# EAGLE design YAKS2-TITUO.R04.1bl (EAGLE 9.0.0)
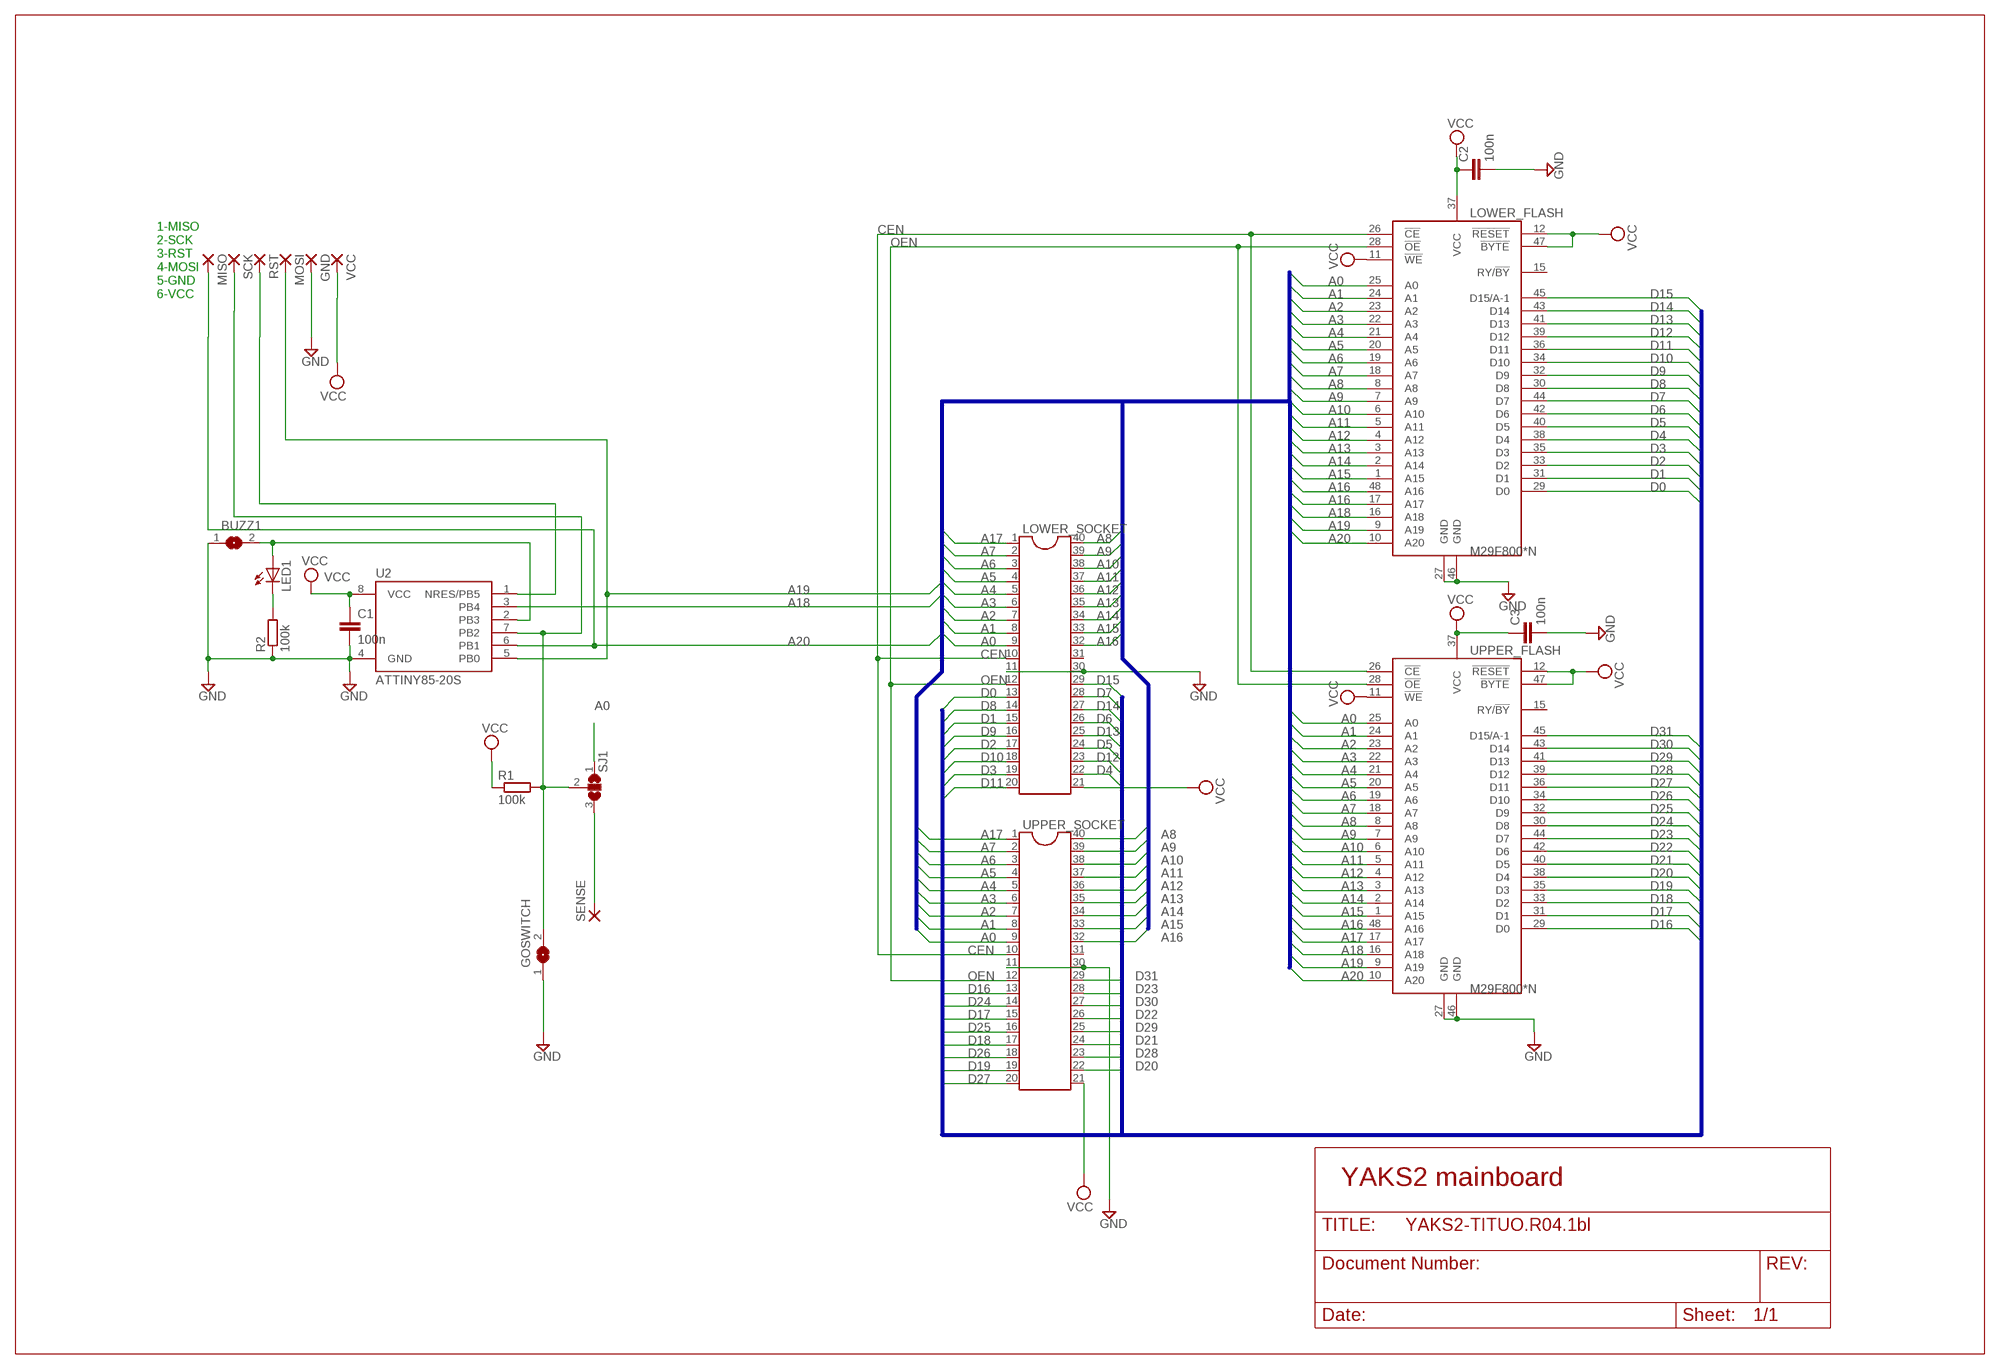
[diagram p0: schematic, sheet 1]

## Parts
BUZZ1  SJ  [SJ]
C1  100n  C-EUC0805  [C0805]
C2  100n  C-EUC0805  [C0805]
C3  100n  C-EUC0805  [C0805]
GND  SMD2  [SMD1,27-2,54]
GOSWITCH  SJ  [SJ]
LED1  LEDSML0805  [SML0805]
LOWER_FLASH  M29F800*N  [48-TSOP]
LOWER_SOCKET  DIL40DIL40SMALLPIN  [DIL40SMALLPIN]
MISO  SMD2  [SMD1,27-2,54]
MOSI  SMD2  [SMD1,27-2,54]
R1  100k  R-EU_M0805  [M0805]
R2  100k  R-EU_M0805  [M0805]
RST  SMD2  [SMD1,27-2,54]
SCK  SMD2  [SMD1,27-2,54]
SENSE  SMD2  [SMD1,27-2,54]
SJ1  SJ2W  [SJ_2]
U2  ATTINY85-20S  [SOIC8_EIAJ_208MIL]
UPPER_FLASH  M29F800*N  [48-TSOP]
UPPER_SOCKET  DIL40DIL40SMALLPIN  [DIL40SMALLPIN]
VCC  SMD2  [SMD1,27-2,54]

## Nets
A0: LOWER_FLASH.25(A0) LOWER_SOCKET.9 SJ1.1 UPPER_FLASH.25(A0) UPPER_SOCKET.9
A1: LOWER_FLASH.24(A1) LOWER_SOCKET.8 UPPER_FLASH.24(A1) UPPER_SOCKET.8
A2: LOWER_FLASH.23(A2) LOWER_SOCKET.7 UPPER_FLASH.23(A2) UPPER_SOCKET.7
A3: LOWER_FLASH.22(A3) LOWER_SOCKET.6 UPPER_FLASH.22(A3) UPPER_SOCKET.6
A4: LOWER_FLASH.21(A4) LOWER_SOCKET.5 UPPER_FLASH.21(A4) UPPER_SOCKET.5
A5: LOWER_FLASH.20(A5) LOWER_SOCKET.4 UPPER_FLASH.20(A5) UPPER_SOCKET.4
A6: LOWER_FLASH.19(A6) LOWER_SOCKET.3 UPPER_FLASH.19(A6) UPPER_SOCKET.3
A7: LOWER_FLASH.18(A7) LOWER_SOCKET.2 UPPER_FLASH.18(A7) UPPER_SOCKET.2
A8: LOWER_FLASH.8(A8) LOWER_SOCKET.40 UPPER_FLASH.8(A8) UPPER_SOCKET.40
A9: LOWER_FLASH.7(A9) LOWER_SOCKET.39 UPPER_FLASH.7(A9) UPPER_SOCKET.39
A10: LOWER_FLASH.6(A10) LOWER_SOCKET.38 UPPER_FLASH.6(A10) UPPER_SOCKET.38
A11: LOWER_FLASH.5(A11) LOWER_SOCKET.37 UPPER_FLASH.5(A11) UPPER_SOCKET.37
A12: LOWER_FLASH.4(A12) LOWER_SOCKET.36 UPPER_FLASH.4(A12) UPPER_SOCKET.36
A13: LOWER_FLASH.3(A13) LOWER_SOCKET.35 UPPER_FLASH.3(A13) UPPER_SOCKET.35
A14: LOWER_FLASH.2(A14) LOWER_SOCKET.34 UPPER_FLASH.2(A14) UPPER_SOCKET.34
A15: LOWER_FLASH.1(A15) LOWER_SOCKET.33 UPPER_FLASH.1(A15) UPPER_SOCKET.33
A16: LOWER_FLASH.48(A16) LOWER_SOCKET.32 UPPER_FLASH.48(A16) UPPER_SOCKET.32
A17: LOWER_FLASH.17(A17) LOWER_SOCKET.1 UPPER_FLASH.17(A17) UPPER_SOCKET.1
A18: LOWER_FLASH.16(A18) U2.3(PB4) UPPER_FLASH.16(A18)
A19: LOWER_FLASH.9(A19) MOSI.1(P) U2.5(PB0) UPPER_FLASH.9(A19)
A20: LOWER_FLASH.10(A20) MISO.1(P) U2.6(PB1) UPPER_FLASH.10(A20)
BUZZ1: BUZZ1.2 LED1.A U2.2(PB3)
CEN: LOWER_FLASH.26(!CE) LOWER_SOCKET.10 UPPER_FLASH.26(!CE) UPPER_SOCKET.10
D0: LOWER_FLASH.29(D0) LOWER_SOCKET.13
D1: LOWER_FLASH.31(D1) LOWER_SOCKET.15
D2: LOWER_FLASH.33(D2) LOWER_SOCKET.17
D3: LOWER_FLASH.35(D3) LOWER_SOCKET.19
D4: LOWER_FLASH.38(D4) LOWER_SOCKET.22
D5: LOWER_FLASH.40(D5) LOWER_SOCKET.24
D6: LOWER_FLASH.42(D6) LOWER_SOCKET.26
D7: LOWER_FLASH.44(D7) LOWER_SOCKET.28
D8: LOWER_FLASH.30(D8) LOWER_SOCKET.14
D9: LOWER_FLASH.32(D9) LOWER_SOCKET.16
D10: LOWER_FLASH.34(D10) LOWER_SOCKET.18
D11: LOWER_FLASH.36(D11) LOWER_SOCKET.20
D12: LOWER_FLASH.39(D12) LOWER_SOCKET.23
D13: LOWER_FLASH.41(D13) LOWER_SOCKET.25
D14: LOWER_FLASH.43(D14) LOWER_SOCKET.27
D15: LOWER_FLASH.45(D15/A-1) LOWER_SOCKET.29
D16: UPPER_FLASH.29(D0) UPPER_SOCKET.13
D17: UPPER_FLASH.31(D1) UPPER_SOCKET.15
D18: UPPER_FLASH.33(D2) UPPER_SOCKET.17
D19: UPPER_FLASH.35(D3) UPPER_SOCKET.19
D20: UPPER_FLASH.38(D4) UPPER_SOCKET.22
D21: UPPER_FLASH.40(D5) UPPER_SOCKET.24
D22: UPPER_FLASH.42(D6) UPPER_SOCKET.26
D23: UPPER_FLASH.44(D7) UPPER_SOCKET.28
D24: UPPER_FLASH.30(D8) UPPER_SOCKET.14
D25: UPPER_FLASH.32(D9) UPPER_SOCKET.16
D26: UPPER_FLASH.34(D10) UPPER_SOCKET.18
D27: UPPER_FLASH.36(D11) UPPER_SOCKET.20
D28: UPPER_FLASH.39(D12) UPPER_SOCKET.23
D29: UPPER_FLASH.41(D13) UPPER_SOCKET.25
D30: UPPER_FLASH.43(D14) UPPER_SOCKET.27
D31: UPPER_FLASH.45(D15/A-1) UPPER_SOCKET.29
GND: BUZZ1.1 C1.2 C2.2 C3.2 GND.1(P) GOSWITCH.1 LOWER_FLASH.27(GND) LOWER_FLASH.46(GND) LOWER_SOCKET.11 LOWER_SOCKET.30 R2.1 U2.4(GND) UPPER_FLASH.27(GND) UPPER_FLASH.46(GND) UPPER_SOCKET.11 UPPER_SOCKET.30
N$1: LED1.C R2.2
N$4: RST.1(P) U2.1(NRES/PB5)
N$8: SENSE.1(P) SJ1.3
OEN: LOWER_FLASH.28(!OE) LOWER_SOCKET.12 UPPER_FLASH.28(!OE) UPPER_SOCKET.12
SCK/PB2: GOSWITCH.2 R1.2 SCK.1(P) SJ1.2 U2.7(PB2)
VCC: C1.1 C2.1 C3.1 LOWER_FLASH.11(!WE) LOWER_FLASH.12(!RESET) LOWER_FLASH.37(VCC) LOWER_FLASH.47(!BYTE) LOWER_SOCKET.21 R1.1 U2.8(VCC) UPPER_FLASH.11(!WE) UPPER_FLASH.12(!RESET) UPPER_FLASH.37(VCC) UPPER_FLASH.47(!BYTE) UPPER_SOCKET.21 VCC.1(P)
Unconnected: LOWER_FLASH.15(RY/!BY) LOWER_SOCKET.31 UPPER_FLASH.15(RY/!BY) UPPER_SOCKET.31

## Buses
A[0..20]
D[0..31]

## Notes on the sheet
- 1-MISO
  2-SCK
  3-RST
  4-MOSI
  5-GND
  6-VCC
- YAKS2 mainboard

## Library data of the parts
BUZZ1 GOSWITCH = jumper:SJ: SMD solder JUMPER
C1-C3 = resistor:C-EU: CAPACITOR, European symbol
GND MISO MOSI RST SCK SENSE VCC = wirepad:SMD2: SMD PAD
LED1 = led:LED: LED OSRAM: - CHIPLED LG R971, LG N971, LY N971, LG Q971, LY Q971, LO R971, LY R971 LH N974, LH R974 LS Q976, LO Q976, LY Q976 LO Q996 - Hyper CHIPLED LW Q18S LB Q993, LB Q99A, LB R99A - SideLED LS A670, LO A670, LY A670, LG A670, LP A670 LB A673, LV A673, LT A673, LW A673 LH A674 LY A675 LS A676, LA A676, LO A676, LY A676, LW A676 LS A679, LY A679, LG A679 - Hyper Micro SIDELED® LS Y876, LA Y876, LO Y876, LY Y876 LT Y87S - SmartLED LW L88C, LW L88S LB L89C, LB L89S, LG L890 LS L89K, LO L89K, LY L89K LS L896, LA L896, LO L896, LY L896 - TOPLED LS T670, LO T670, LY T670, LG T670, LP T670 LSG T670, LSP T670, LSY T670, LOP T670, LYG T670 LG T671, LOG T671, LSG T671 LB T673, LV T673, LT T673, LW T673 LH T674 LS T676, LA T676, LO T676, LY T676, LB T676, LH T676, LSB T676, LW T676 LB T67C, LV T67C, LT T67C, LS T67K, LO T67K, LY T67K, LW E67C LS E67B, LA E67B, LO E67B, LY E67B, LB E67C, LV E67C, LT E67C LW T67C LS T679, LY T679, LG T679 LS T770, LO T770, LY T770, LG T770, LP T770 LB T773, LV T773, LT T773, LW T773 LH T774 LS E675, LA E675, LY E675, LS T675 LS T776, LA T776, LO T776, LY T776, LB T776 LHGB T686 LT T68C, LB T68C - Hyper Mini TOPLED® LB M676 - Mini TOPLED Santana® LG M470 LS M47K, LO M47K, LY M47K Source: http://www.osram.convergy.de LUXEON: - LUMILED® LXK2-PW12-R00, LXK2-PW12-S00, LXK2-PW14-U00, LXK2-PW14-V00 LXK2-PM12-R00, LXK2-PM12-S00, LXK2-PM14-U00 LXK2-PE12-Q00, LXK2-PE12-R00, LXK2-PE12-S00, LXK2-PE14-T00, LXK2-PE14-U00 LXK2-PB12-K00, LXK2-PB12-L00, LXK2-PB12-M00, LXK2-PB14-N00, LXK2-PB14-P00, LXK2-PB14-Q00 LXK2-PR12-L00, LXK2-PR12-M00, LXK2-PR14-Q00, LXK2-PR14-R00 LXK2-PD12-Q00, LXK2-PD12-R00, LXK2-PD12-S00 LXK2-PH12-R00, LXK2-PH12-S00 LXK2-PL12-P00, LXK2-PL12-Q00, LXK2-PL12-R00 Source: www.luxeon.com KINGBRIGHT: KA-3528ASYC Source: www.kingbright.com
LOWER_FLASH UPPER_FLASH = snes_cart:M29F800: 8MBit 5V Flash ROM (1M x 8/512K x 16) Manufactured by Micron
LOWER_SOCKET UPPER_SOCKET = ic-package:DIL40: Dual In Line
R1 R2 = resistor:R-EU_: RESISTOR, European symbol
SJ1 = jumper:SJ2W: SMD solder JUMPER
U2 = _hhn_attiny25_45_85:ATTINY85*: ATMEL ATtiny 85 Packages: P = PDIP 08 30mil S = SOIC 08 EIAJ 208mil Technologies Note: for complete ordering code (temp. range, finish, tape&reel etc.) see www.atmel.com • Supply Voltage: V = (1.8…5.5)V | [blank] = (2.7…5.5)V • Speed: 10 = 10 MHz | 20 = 20 MHz Author: Dipl.-Ing. FH Rainer Bayer HHN Hochschule Heilbronn (Heilbronn University), rainer.bayer@hs-heilbronn.de Ingenieurbüro ing-rb, mail@ing-rb.de

## Board
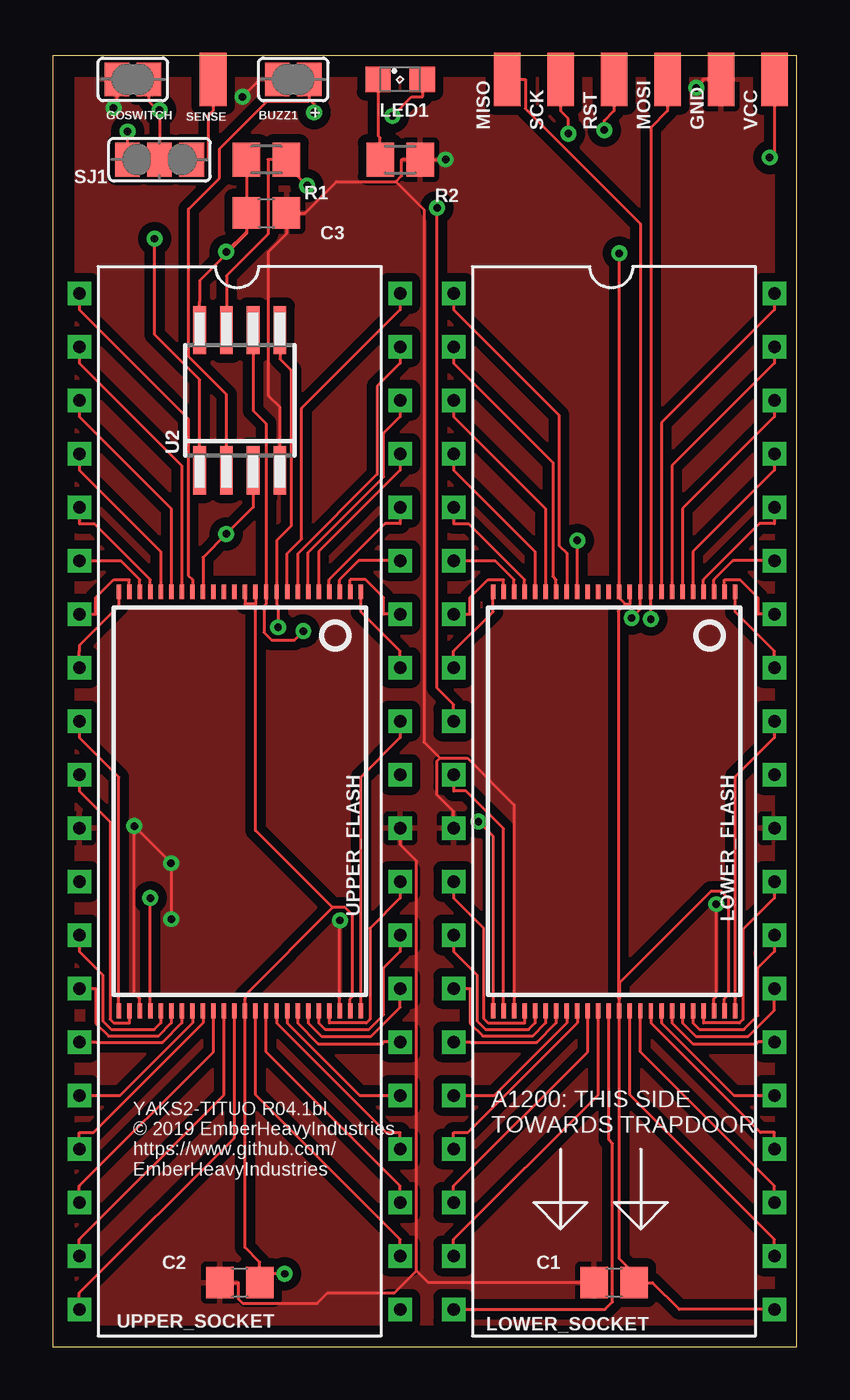
[diagram p1: board, top side]
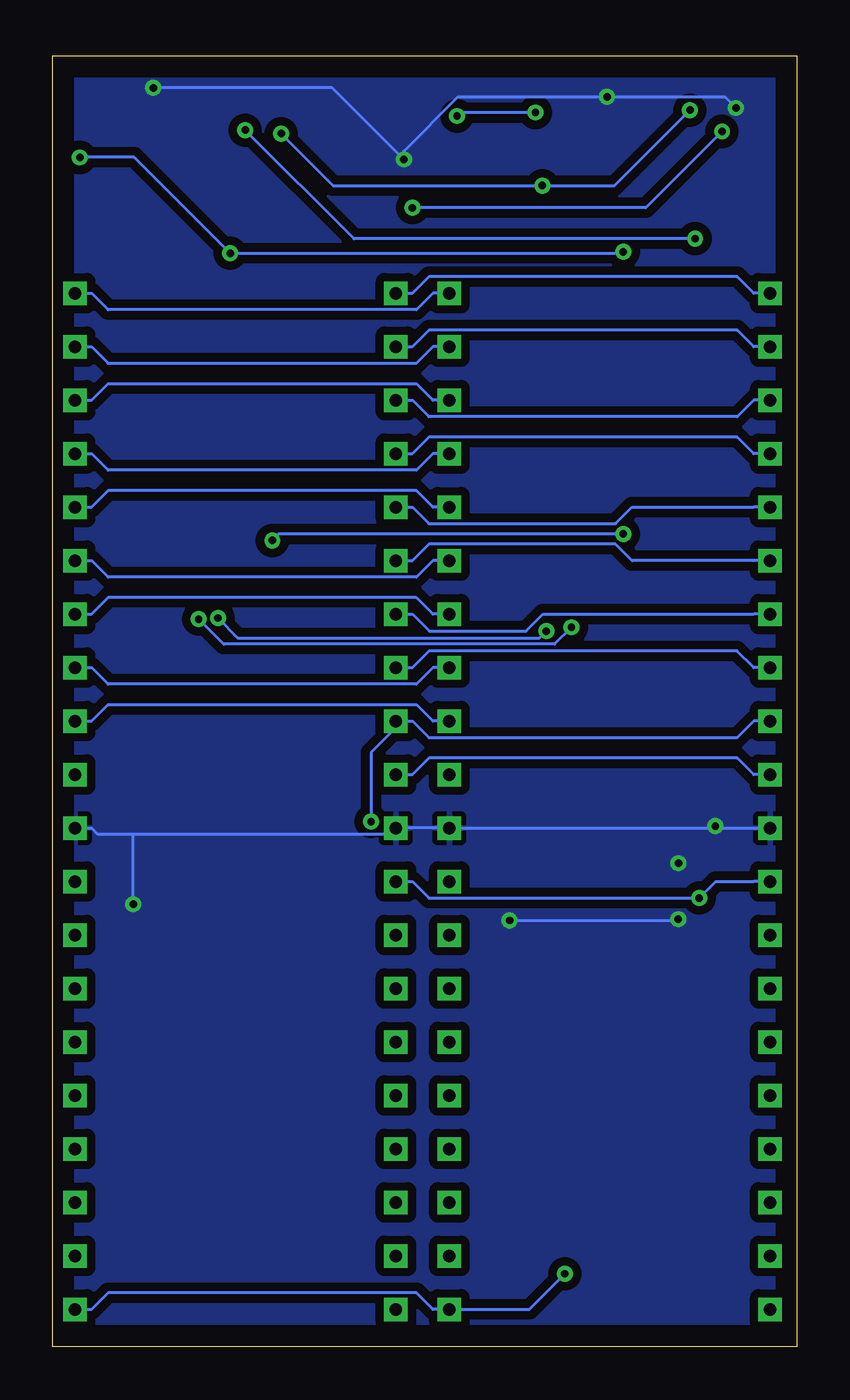
[diagram p2: board, bottom side, seen from below]

Size 35.36 x 61.33 mm. Coordinates in mm from the lower left corner, seen from the top.
Outline: 0,0 35.36,0 35.36,61.33 0,61.33 0,0
Copper layers (1*16): Top 0.035mm / dielectric 1.5mm / Bottom 0.035mm
Design rules "default": minimum track width 6mil, minimum drill 0.35mm, track to track 6mil, track to pad 6mil, pad to pad 6mil, via to via 6mil, smd to smd 6mil, copper to edge 40mil, drill to drill 6mil, minimum pad ring 10mil, minimum via ring 8mil, stop-mask expansion 4mil, vias tented up to drill 0mil, thermal gap 10mil

### Footprints (pad centres in the part's own frame; a part is rotated, then mirrored left to right if it is on the bottom)
SJ = smd 1.168 x 1.6: 1 -0.762,0; 2 0.762,0
C0805 = smd 1.3 x 1.5: 1 -0.95,0; 2 0.95,0
SMD1,27-2,54 = smd 1.27 x 2.54: 1 0,0
SML0805 = smd 1.2 x 1.2: A 1.05,0; C -1.05,0
48-TSOP = smd 0.7 x 0.21: 1 -9.95,5.75; 2 -9.95,5.25; 3 -9.95,4.75; 4 -9.95,4.25; 5 -9.95,3.75; 6 -9.95,3.25; 7 -9.95,2.75; 8 -9.95,2.25; 9 -9.95,1.75; 10 -9.95,1.25; 11 -9.95,0.75; 12 -9.95,0.25; 13 -9.95,-0.25; 14 -9.95,-0.75; 15 -9.95,-1.25; 16 -9.95,-1.75; 17 -9.95,-2.25; 18 -9.95,-2.75; 19 -9.95,-3.25; 20 -9.95,-3.75; 21 -9.95,-4.25; 22 -9.95,-4.75; 23 -9.95,-5.25; 24 -9.95,-5.75; 25 9.95,-5.75; 26 9.95,-5.25; 27 9.95,-4.75; 28 9.95,-4.25; 29 9.95,-3.75; 30 9.95,-3.25; 31 9.95,-2.75; 32 9.95,-2.25; 33 9.95,-1.75; 34 9.95,-1.25; 35 9.95,-0.75; 36 9.95,-0.25; 37 9.95,0.25; 38 9.95,0.75; 39 9.95,1.25; 40 9.95,1.75; 41 9.95,2.25; 42 9.95,2.75; 43 9.95,3.25; 44 9.95,3.75; 45 9.95,4.25; 46 9.95,4.75; 47 9.95,5.25; 48 9.95,5.75
DIL40SMALLPIN = drill 0.6 square: 1 -22.86,-7.62; 2 -20.32,-7.62; 3 -17.78,-7.62; 4 -15.24,-7.62; 5 -12.7,-7.62; 6 -10.16,-7.62; 7 -7.62,-7.62; 8 -5.08,-7.62; 9 -2.54,-7.62; 10 0,-7.62; 11 2.54,-7.62; 12 5.08,-7.62; 13 7.62,-7.62; 14 10.16,-7.62; 15 12.7,-7.62; 16 15.24,-7.62; 17 17.78,-7.62; 18 20.32,-7.62; 19 22.86,-7.62; 20 25.4,-7.62; 21 25.4,7.62; 22 22.86,7.62; 23 20.32,7.62; 24 17.78,7.62; 25 15.24,7.62; 26 12.7,7.62; 27 10.16,7.62; 28 7.62,7.62; 29 5.08,7.62; 30 2.54,7.62; 31 0,7.62; 32 -2.54,7.62; 33 -5.08,7.62; 34 -7.62,7.62; 35 -10.16,7.62; 36 -12.7,7.62; 37 -15.24,7.62; 38 -17.78,7.62; 39 -20.32,7.62; 40 -22.86,7.62
M0805 = smd 1.3 x 1.6: 1 -0.95,0; 2 0.95,0
SJ_2 = smd 1.168 x 1.6: 1 -1.524,0; 2 0,0; 3 1.524,0
SOIC8_EIAJ_208MIL = smd 0.6 x 2.286: 1 -1.905,-3.33; 2 -0.635,-3.33; 3 0.635,-3.33; 4 1.905,-3.33; 5 1.905,3.33; 6 0.635,3.33; 7 -0.635,3.33; 8 -1.905,3.33

### Placement (x,y rotation side)
BUZZ1  11.43,60.2 0 top
C1  26.67,3.05 180 top
C2  8.89,3.05 180 top
C3  10.16,53.85 0 top
GND  31.75,60.2 0 top
GOSWITCH  3.81,60.2 0 top
LED1  16.51,60.2 0 top
LOWER_FLASH  26.67,25.91 270 top
LOWER_SOCKET  26.67,27.18 270 top
MISO  21.59,60.2 0 top
MOSI  29.21,60.2 0 top
R1  10.16,56.39 0 top
R2  16.51,56.39 180 top
RST  26.67,60.2 0 top
SCK  24.13,60.2 0 top
SENSE  7.62,60.2 0 top
SJ1  5.08,56.39 0 top
U2  8.89,44.96 0 top
UPPER_FLASH  8.89,25.91 270 top
UPPER_SOCKET  8.89,27.18 270 top
VCC  34.29,60.2 0 top

### Tracks (layer width: path | path; a pad name or v marks a point on that pad's centre or on a via)
A0  (via drill 0.35 pad 0.76)
  Top 0.152: v18.27,54.1 18.27,31.28 19.05,30.5 LOWER_SOCKET.9 | SJ1.1 v3.56,57.72 | v20.23,24.95 20.92,24.26 LOWER_FLASH.25 | UPPER_SOCKET.9 1.27,28.93 3.14,27.07 UPPER_FLASH.25
  Bottom 0.152: v3.56,57.72 7.18,54.1 v18.27,54.1 | 18.73,29.72 20.23,28.22 v20.23,24.95 | 18.73,29.72 18.27,29.72 17.48,28.93 2.84,28.93 2.05,29.72 UPPER_SOCKET.9 | LOWER_SOCKET.9 18.73,29.72
A1
  Top 0.152: UPPER_FLASH.24 3.14,35.19 1.27,33.32 1.27,33.04 UPPER_SOCKET.8 | LOWER_SOCKET.8 19.05,33.04 20.92,34.91 LOWER_FLASH.24
  Bottom 0.152: LOWER_SOCKET.8 18.27,32.26 17.47,33.06 2.85,33.06 2.05,32.26 UPPER_SOCKET.8
A2
  Top 0.152: LOWER_FLASH.23 21.42,36.44 20.69,36.44 19.83,35.58 19.83,34.8 LOWER_SOCKET.7 | UPPER_FLASH.23 3.64,36.44 2.91,36.44 2.05,35.58 2.05,34.8 UPPER_SOCKET.7
  Bottom 0.152: LOWER_SOCKET.7 18.27,34.8 17.46,34 12.86,34 12.06,34.8 2.05,34.8 UPPER_SOCKET.7
A3
  Top 0.152: LOWER_FLASH.22 21.92,36.44 21.02,37.34 LOWER_SOCKET.6 | UPPER_FLASH.22 4.14,36.44 3.24,37.34 UPPER_SOCKET.6
  Bottom 0.152: LOWER_SOCKET.6 18.27,37.34 17.48,38.12 8.62,38.12 7.84,37.34 2.05,37.34 UPPER_SOCKET.6
A4
  Top 0.152: LOWER_FLASH.21 22.42,36.44 19.76,39.09 19.05,39.09 LOWER_SOCKET.5 | UPPER_FLASH.21 4.64,36.44 1.98,39.09 1.27,39.09 UPPER_SOCKET.5
  Bottom 0.152: LOWER_SOCKET.5 18.27,39.88 17.48,39.09 8.62,39.09 7.84,39.88 2.05,39.88 UPPER_SOCKET.5
A5
  Top 0.152: UPPER_FLASH.20 5.14,37.77 1.27,41.63 UPPER_SOCKET.4 | LOWER_SOCKET.4 19.05,41.63 22.92,37.77 LOWER_FLASH.20
  Bottom 0.152: LOWER_SOCKET.4 18.27,42.42 17.48,43.2 2.84,43.2 2.05,42.42 UPPER_SOCKET.4
A6
  Top 0.152: UPPER_FLASH.19 5.64,39.8 1.27,44.17 UPPER_SOCKET.3 | LOWER_SOCKET.3 19.05,44.17 23.42,39.8 LOWER_FLASH.19
  Bottom 0.152: LOWER_SOCKET.3 18.27,44.96 17.48,44.17 2.84,44.17 2.05,44.96 UPPER_SOCKET.3
A7
  Top 0.152: LOWER_FLASH.18 23.92,36.44 23.76,36.6 23.76,42.01 19.05,46.72 LOWER_SOCKET.2 | UPPER_FLASH.18 6.14,41.84 1.27,46.72 UPPER_SOCKET.2
  Bottom 0.152: LOWER_SOCKET.2 18.27,47.5 17.48,48.28 2.84,48.28 2.05,47.5 UPPER_SOCKET.2
A8
  Top 0.152: LOWER_SOCKET.40 34.29,49.25 28.92,43.88 LOWER_FLASH.8 | UPPER_SOCKET.40 16.51,49.25 11.83,44.58 11.83,38.37 11.14,37.69 UPPER_FLASH.8
  Bottom 0.152: LOWER_SOCKET.40 33.51,50.04 32.72,49.25 18.07,49.25 17.29,50.04 UPPER_SOCKET.40
A9
  Top 0.152: LOWER_SOCKET.39 34.29,46.72 29.42,41.84 LOWER_FLASH.7 | UPPER_FLASH.7 11.64,37.66 15.42,41.44 15.42,45.63 16.51,46.72 UPPER_SOCKET.39
  Bottom 0.152: UPPER_SOCKET.39 17.29,47.5 18.07,46.72 32.72,46.72 33.51,47.5 LOWER_SOCKET.39
A10
  Top 0.152: LOWER_SOCKET.38 34.29,44.17 29.92,39.8 LOWER_FLASH.6 | UPPER_SOCKET.38 16.51,44.17 15.73,43.39 15.73,41.31 12.14,37.73 UPPER_FLASH.6
  Bottom 0.152: UPPER_SOCKET.38 17.29,44.96 18.07,45.74 32.72,45.74 33.51,44.96 LOWER_SOCKET.38
A11
  Top 0.152: LOWER_SOCKET.37 34.29,41.63 30.42,37.77 LOWER_FLASH.5 | UPPER_SOCKET.37 16.51,41.63 12.64,37.77 UPPER_FLASH.5
  Bottom 0.152: LOWER_SOCKET.37 33.51,42.42 32.72,41.63 18.07,41.63 17.29,42.42 UPPER_SOCKET.37
A12
  Top 0.152: LOWER_FLASH.4 30.92,36.44 33.58,39.09 34.29,39.09 LOWER_SOCKET.36 | UPPER_FLASH.4 13.14,36.44 15.8,39.09 16.51,39.09 UPPER_SOCKET.36
  Bottom 0.152: LOWER_SOCKET.36 33.51,39.88 32.72,40.66 18.07,40.66 17.29,39.88 UPPER_SOCKET.36
A13
  Top 0.152: LOWER_FLASH.3 31.42,36.44 32.32,37.34 LOWER_SOCKET.35 | UPPER_FLASH.3 13.64,36.44 14.54,37.34 UPPER_SOCKET.35
  Bottom 0.152: LOWER_SOCKET.35 33.51,37.34 32.72,36.56 18.07,36.56 17.29,37.34 UPPER_SOCKET.35
A14
  Top 0.152: LOWER_SOCKET.34 33.51,34.8 33.51,35.58 32.65,36.44 31.92,36.44 LOWER_FLASH.2 | UPPER_FLASH.2 14.14,36.44 14.87,36.44 15.73,35.58 15.73,34.8 UPPER_SOCKET.34
  Bottom 0.152: LOWER_SOCKET.34 33.51,34.8 32.7,35.61 18.1,35.61 17.29,34.8 UPPER_SOCKET.34
A15
  Top 0.152: LOWER_SOCKET.33 34.29,33.04 32.42,34.91 LOWER_FLASH.1 | UPPER_SOCKET.33 16.51,33.04 14.64,34.91 UPPER_FLASH.1
  Bottom 0.152: LOWER_SOCKET.33 33.51,32.26 32.72,31.47 18.08,31.47 17.29,32.26 UPPER_SOCKET.33
A16
  Top 0.152: LOWER_FLASH.48 32.42,16.54 32.44,16.55 32.44,27.08 34.29,28.93 LOWER_SOCKET.32 | UPPER_FLASH.48 14.64,16.54 14.64,27.07 16.51,28.93 UPPER_SOCKET.32
  Bottom 0.152: UPPER_SOCKET.32 17.29,29.72 18.07,30.5 32.72,30.5 33.51,29.72 LOWER_SOCKET.32
A17
  Top 0.152: LOWER_FLASH.17 24.42,37.69 24.06,38.05 24.06,44.24 19.05,49.25 LOWER_SOCKET.1 | UPPER_SOCKET.1 1.27,49.25 6.45,44.08 6.45,36.63 6.64,36.44 UPPER_FLASH.17
  Bottom 0.152: LOWER_SOCKET.1 18.27,50.04 17.48,50.82 2.84,50.82 2.05,50.04 UPPER_SOCKET.1
A18  (via drill 0.35 pad 0.76)
  Top 0.152: UPPER_FLASH.16 7.14,37.5 v8.25,38.61 9.53,39.88 U2.3 | LOWER_FLASH.16 v24.92,38.3
  Bottom 0.152: v8.25,38.61 24.62,38.61 v24.92,38.3
A19  (via drill 0.35 pad 0.76)
  Top 0.152: MOSI.1 29.21,58.7 28.42,57.91 LOWER_FLASH.9 v28.42,34.56 | v10.71,34.17 10.71,35.21 10.64,35.28 UPPER_FLASH.9 10.64,38.3 11.32,38.98 11.32,46.39 10.79,46.92 U2.5
  Bottom 0.152: v10.71,34.17 11.51,33.37 27.23,33.37 v28.42,34.56
A20  (via drill 0.35 pad 0.76)
  Top 0.152: MISO.1 22.45,60.2 22.45,58.81 27.92,53.34 LOWER_FLASH.10 27.92,35.03 v27.5,34.62 | v11.91,33.99 11.49,33.57 10.4,33.57 10.04,33.93 10.04,35.18 10.14,35.28 UPPER_FLASH.10 10.14,43.85 9.53,44.46 U2.6
  Bottom 0.152: v27.5,34.62 26.57,33.68 12.22,33.68 v11.91,33.99
BUZZ1  (via drill 0.35 pad 0.76)
  Top 0.152: LED1.A 17.56,59.37 17.06,59.37 v16.15,58.46 | 12.19,59.26 12.42,59.03 v12.42,58.63 | 12.19,59.26 12.19,59.17 10.19,59.17 7.93,56.9 7.93,55.51 6.45,54.04 6.45,47.04 8.26,45.23 U2.2 | BUZZ1.2 12.19,59.26
  Bottom 0.152: v12.42,58.63 15.98,58.63 v16.15,58.46
CEN
  Top 0.152: LOWER_FLASH.26 21.42,24.62 19.64,26.39 19.05,26.39 LOWER_SOCKET.10 | UPPER_FLASH.26 3.64,15.38 2.91,15.38 2.73,15.56 2.73,24.94 1.27,26.39 UPPER_SOCKET.10
  Bottom 0.152: LOWER_SOCKET.10 18.27,27.18 17.48,27.96 2.84,27.96 2.05,27.18 UPPER_SOCKET.10
D0
  Top 0.152: LOWER_SOCKET.13 19.05,18.78 20.16,17.66 20.16,15.47 20.56,15.07 22.62,15.07 22.92,15.38 LOWER_FLASH.29
D1
  Top 0.152: LOWER_SOCKET.15 19.83,14.48 19.85,14.46 23,14.46 23.92,15.38 LOWER_FLASH.31
D2
  Top 0.152: LOWER_FLASH.33 24.92,15.38 19.72,10.18 19.05,10.18 LOWER_SOCKET.17
D3
  Top 0.152: LOWER_SOCKET.19 19.05,5.1 25.92,11.97 LOWER_FLASH.35
D4
  Top 0.152: LOWER_SOCKET.22 34.29,5.1 27.42,11.97 LOWER_FLASH.38
D5
  Top 0.152: LOWER_FLASH.40 28.42,15.38 33.62,10.18 34.29,10.18 LOWER_SOCKET.24
D6
  Top 0.152: LOWER_SOCKET.26 33.51,14.48 33.43,14.4 30.4,14.4 29.42,15.38 LOWER_FLASH.42
D7
  Top 0.152: LOWER_FLASH.44 30.42,15.38 30.73,15.07 32.84,15.07 33.51,15.74 33.51,17.99 34.29,18.78 LOWER_SOCKET.28
D8
  Top 0.152: LOWER_FLASH.30 23.42,15.38 22.81,14.77 20.44,14.77 19.83,15.37 19.83,17.02 LOWER_SOCKET.14
D9
  Top 0.152: LOWER_FLASH.32 24.42,15.38 20.98,11.94 LOWER_SOCKET.16
D10
  Top 0.152: LOWER_SOCKET.18 19.05,7.64 25.42,14.01 LOWER_FLASH.34
D11
  Top 0.152: LOWER_SOCKET.20 26.25,1.78 26.6,2.13 26.6,9.65 26.42,9.83 LOWER_FLASH.36
D12
  Top 0.152: LOWER_SOCKET.23 34.29,7.64 27.92,14.01 LOWER_FLASH.39
D13
  Top 0.152: LOWER_SOCKET.25 32.36,11.94 28.92,15.38 LOWER_FLASH.41
D14
  Top 0.152: LOWER_SOCKET.27 34.29,15.99 33.05,14.75 30.55,14.75 29.92,15.38 LOWER_FLASH.43
D15
  Top 0.152: LOWER_FLASH.45 30.92,15.38 32.62,15.38 32.79,15.54 32.79,19.82 34.29,21.32 LOWER_SOCKET.29
D16
  Top 0.152: UPPER_FLASH.29 5.14,15.38 4.84,15.07 2.78,15.07 2.38,15.48 2.38,17.67 1.27,18.78 UPPER_SOCKET.13
D17
  Top 0.152: UPPER_SOCKET.15 2.05,14.48 2.07,14.46 5.22,14.46 6.14,15.38 UPPER_FLASH.31
D18
  Top 0.152: UPPER_FLASH.33 7.14,15.38 1.94,10.18 1.27,10.18 UPPER_SOCKET.17
D19
  Top 0.152: UPPER_SOCKET.19 1.27,5.1 8.14,11.97 UPPER_FLASH.35
D20
  Top 0.152: UPPER_FLASH.38 9.64,11.97 16.51,5.1 UPPER_SOCKET.22
D21
  Top 0.152: UPPER_FLASH.40 10.64,15.38 15.84,10.18 16.51,10.18 UPPER_SOCKET.24
D22
  Top 0.152: UPPER_SOCKET.26 15.73,14.48 15.65,14.4 12.62,14.4 11.64,15.38 UPPER_FLASH.42
D23
  Top 0.152: UPPER_FLASH.44 12.64,15.38 12.95,15.07 15.03,15.07 15.73,15.77 15.73,17.99 16.51,18.78 UPPER_SOCKET.28
D24
  Top 0.152: UPPER_SOCKET.14 2.05,17.02 2.05,15.37 2.66,14.77 5.03,14.77 5.64,15.38 UPPER_FLASH.30
D25
  Top 0.152: UPPER_FLASH.32 6.64,15.38 3.2,11.94 UPPER_SOCKET.16
D26
  Top 0.152: UPPER_SOCKET.18 1.27,7.64 7.64,14.01 UPPER_FLASH.34
D27
  Top 0.152: UPPER_SOCKET.20 1.27,2.56 8.64,9.93 UPPER_FLASH.36
D28
  Top 0.152: UPPER_SOCKET.23 16.51,7.64 10.14,14.01 UPPER_FLASH.39
D29
  Top 0.152: UPPER_SOCKET.25 14.58,11.94 11.14,15.38 UPPER_FLASH.41
D30
  Top 0.152: UPPER_SOCKET.27 16.51,16.13 15.14,14.75 12.77,14.75 12.14,15.38 UPPER_FLASH.43
D31
  Top 0.152: UPPER_FLASH.45 13.14,15.38 14.9,15.38 15.08,15.55 15.08,19.88 16.51,21.32 UPPER_SOCKET.29
GND  (via drill 0.35 pad 0.76)
  Top 0.152: v31.53,21.03 31.53,16.64 31.42,16.54 LOWER_FLASH.46 | v5.64,20.31 5.62,20.33 v5.62,22.97 5.62,22.99 v3.88,24.73 3.88,16.8 4.14,16.54 UPPER_FLASH.27 | v13.65,20.25 v13.64,20.25 13.64,16.54 UPPER_FLASH.46 | 17.29,3.62 17.29,23.07 16.51,23.86 UPPER_SOCKET.30 | BUZZ1.1 9.85,60.2 v9.02,59.37 | GOSWITCH.1 3.05,59.17 2.9,59.02 v2.9,58.84 | 16.3,55.34 13.48,55.34 11.99,53.85 C3.2 11.11,52.87 10.27,52.02 10.27,45.16 10.79,44.64 U2.4 | 18.4,27.96 19.7,27.96 21.92,25.75 LOWER_FLASH.27 | 18.4,27.96 18.27,27.83 18.27,26.2 19.05,25.42 LOWER_SOCKET.11 | 16.3,55.34 17.63,54.01 17.63,28.72 18.4,27.96 | 16.3,55.34 16.58,55.62 16.58,56.39 R2.1 18.34,56.39 18.35,56.39 v18.67,56.39 | GND.1 30.89,60.2 30.89,60.11 v30.57,59.8 | 17.29,3.62 16.23,2.56 13.06,2.56 12.57,2.07 9.03,2.07 8.82,2.28 8.82,3.05 C2.2 | C1.2 17.86,3.05 17.29,3.62
  Bottom 0.152: v31.53,21.03 31.53,24.34 | 31.53,24.34 19.34,24.34 LOWER_SOCKET.11 UPPER_SOCKET.30 3.88,24.64 | 31.53,24.34 33.21,24.34 33.51,24.64 LOWER_SOCKET.30 | v13.65,20.25 5.7,20.25 v5.64,20.31 | 3.88,24.64 UPPER_SOCKET.11 | 3.88,24.64 v3.88,24.73 | v2.9,58.84 3.42,59.37 v9.02,59.37 16.1,59.37 18.67,56.8 v18.67,56.39 22.07,59.8 v30.57,59.8
  pour Top (isolate 0.406): 0,61.47 35.56,61.47 35.56,0.51 0,0.51
  pour Bottom (isolate 0.406): 0,61.47 0,0.51 35.56,0.51 35.56,61.47
N$1
  Top 0.152: R2.2 15.56,57.42 15.46,57.52 15.46,59.37 LED1.C
N$4  (via drill 0.35 pad 0.76)
  Top 0.152: RST.1 26.67,58.7 26.21,58.24 v26.21,57.79 | U2.1 6.99,45.93 4.84,48.08 v4.84,52.63
  Bottom 0.152: v4.84,52.63 21.05,52.63 v26.21,57.79
N$8
  Top 0.152: SENSE.1 7.62,58.7 7.42,58.5 7.42,56.39 SJ1.3
OEN  (via drill 0.35 pad 0.76)
  Top 0.152: UPPER_FLASH.28 v4.64,21.32 | LOWER_SOCKET.12 19.05,21.32 20.47,19.89 20.47,15.6 20.69,15.38 22.42,15.38 LOWER_FLASH.28
  Bottom 0.152: UPPER_SOCKET.12 2.05,22.1 3.86,22.1 v4.64,21.32 17.48,21.32 18.27,22.1 LOWER_SOCKET.12
SCK/PB2  (via drill 0.35 pad 0.76)
  Top 0.152: SJ1.2 v5.08,58.74 5,58.74 4.57,59.17 GOSWITCH.2 | 10.86,56.39 v12.09,55.16 | SCK.1 24.13,58.7 24.5,58.33 v24.5,57.62 | R1.2 10.86,56.39 | 10.86,56.39 10.81,56.39 10.23,56.39 10.23,52.85 8.26,50.87 U2.7
  Bottom 0.152: v5.08,58.74 8.66,55.16 v12.09,55.16 22.04,55.16 v24.5,57.62
VCC  (via drill 0.35 pad 0.76)
  Top 0.152: 26.92,16.54 26.92,17.28 31.27,21.63 31.78,21.63 32.13,21.28 32.13,16.75 31.92,16.54 LOWER_FLASH.47 | 13.3,20.86 9.14,16.7 9.14,16.54 UPPER_FLASH.37 9.14,4.73 9.84,4.03 9.84,3.47 | 13.3,20.86 13.9,20.86 14.25,20.5 14.25,16.65 14.14,16.54 UPPER_FLASH.47 | 13.3,20.86 9.64,24.52 9.64,35.28 | v26.92,51.94 LOWER_FLASH.12 26.92,35.57 27.21,35.28 | v8.25,52.01 9.21,52.97 | 9.21,52.97 9.21,52.87 6.99,50.64 6.99,49.66 U2.8 | 9.21,52.97 C3.1 R1.1 | VCC.1 34.29,56.72 v34.07,56.49 | 27.21,35.28 26.87,34.94 26.87,16.59 26.92,16.54 | 9.64,35.28 9.14,35.28 UPPER_FLASH.12 | UPPER_FLASH.11 9.64,35.28 | 28.06,3.05 26.92,4.19 LOWER_FLASH.37 26.92,16.54 | v11.02,3.47 9.84,3.47 | C2.1 9.84,3.47 | 27.21,35.28 27.42,35.28 LOWER_FLASH.11 | 28.06,3.05 28.5,3.05 29.77,1.78 LOWER_SOCKET.21 | C1.1 28.06,3.05
  Bottom 0.152: v8.25,52.01 8.32,51.94 v26.92,51.94 31.47,56.49 v34.07,56.49 | v11.02,3.47 12.71,1.78 UPPER_SOCKET.21 16.82,1.78 17.29,1.78 18.07,2.56 32.72,2.56 33.51,1.78 LOWER_SOCKET.21

### Text on the board
tPlace: A1200: THIS SIDE / TOWARDS TRAPDOOR | YAKS2-TITUO R04.1bl / © 2019 EmberHeavyIndustries / https://www.github.com/ / EmberHeavyIndustries
tNames: +